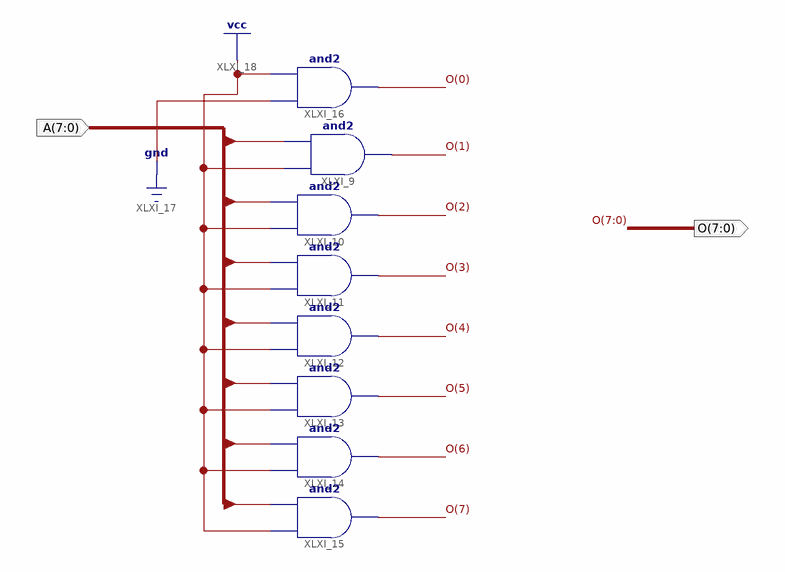
[diagram p0: schematic sheet 1]
// Xilinx ISE schematic shift_state.sch (spartan6) as structural Verilog: 8 symbols, 2 ports
module shift_state (
  input  [7:0] A,
  output [7:0] O
);

  and XLXI_10 (O[2], 1'b1, A[1]);
  and XLXI_11 (O[3], 1'b1, A[2]);
  and XLXI_12 (O[4], 1'b1, A[3]);
  and XLXI_13 (O[5], 1'b1, A[4]);
  and XLXI_14 (O[6], 1'b1, A[5]);
  and XLXI_15 (O[7], 1'b1, A[6]);
  and XLXI_16 (O[0], 1'b0, 1'b1);
  and XLXI_9 (O[1], 1'b1, A[0]);
endmodule
